# Altium project Battery PSU.PrjPCB (part 2 of 2)

## Sheet Lin-reg.SchDoc
size A4
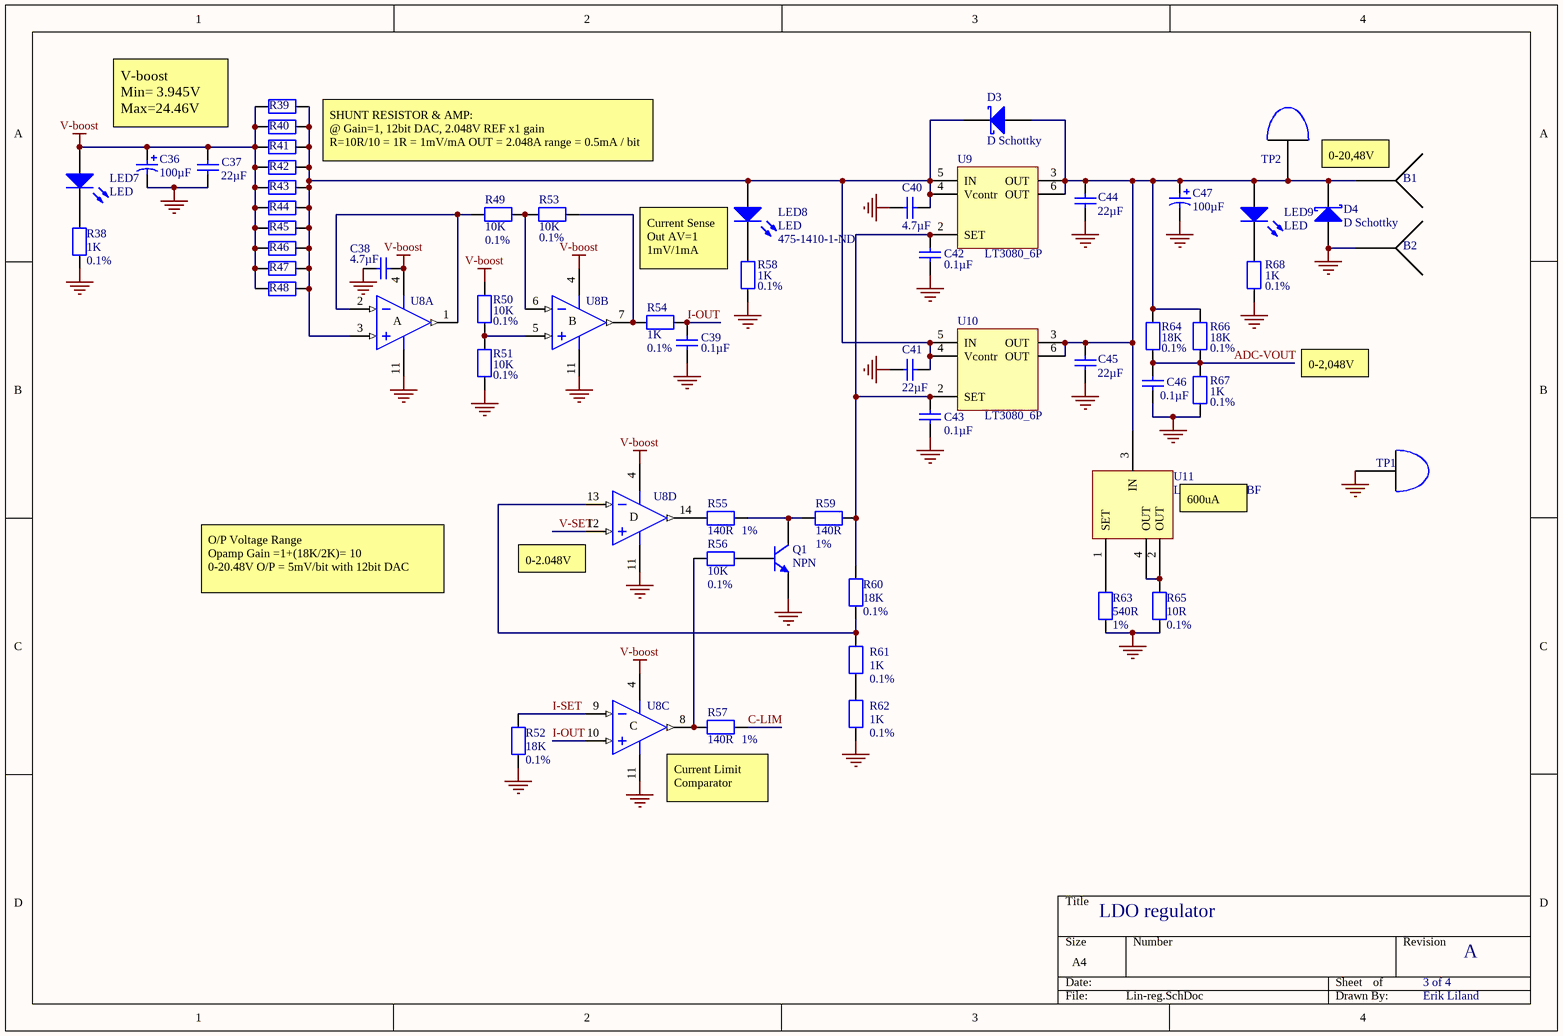
[diagram p2: Lin-reg.SchDoc]

### Parts
B1  Banana socket pcb  [PCB Banana jack red]  (value not drawn)
B2  Banana socket pcb  [PCB Banana jack black]  (value not drawn)
C36  100µF  [CAP SMD (F)]
C37  22µF  [0805_N_CAP]
C38  4.7µF  [0805_N_CAP]
C39  0.1µF  [0805_N_CAP]
C40  4.7µF  [0805_N_CAP]
C41  22µF  [0805_N_CAP]
C42  0.1µF  [0805_N_CAP]
C43  0.1µF  [0805_N_CAP]
C44  22µF  [0805_N_CAP]
C45  22µF  [0805_N_CAP]
C46  0.1µF  [0805_N_CAP]
C47  100µF  [CAP SMD (F)]
D3  D Schottky  [DO-214AC, SMA]
D4  D Schottky  [DO-214AC, SMA]
LED7  LED  [0805_N_LED]
LED8  LED  Supplier Part Number 1: 475-1410-1-ND  [0805_N_LED]
LED9  LED  [0805_N_LED]
Q1  NPN  [SOT-23_N]
R38  1K  Tolerance: 0.1%  [0805_N_RES]
R39  10R  [0805_N_RES]  (value not drawn)
R40  10R  [0805_N_RES]  (value not drawn)
R41  10R  [0805_N_RES]  (value not drawn)
R42  10R  [0805_N_RES]  (value not drawn)
R43  10R  [0805_N_RES]  (value not drawn)
R44  10R  [0805_N_RES]  (value not drawn)
R45  10R  [0805_N_RES]  (value not drawn)
R46  10R  [0805_N_RES]  (value not drawn)
R47  10R  [0805_N_RES]  (value not drawn)
R48  10R  [0805_N_RES]  (value not drawn)
R49  10K  Tolerance: 0.1%  [0805_N_RES]
R50  10K  Tolerance: 0.1%  [0805_N_RES]
R51  10K  Tolerance: 0.1%  [0805_N_RES]
R52  18K  Tolerance: 0.1%  [0805_N_RES]
R53  10K  Tolerance: 0.1%  [0805_N_RES]
R54  1K  Tolerance: 0.1%  [0805_N_RES]
R55  140R  Tolerance: 1%  [0805_N_RES]
R56  10K  Tolerance: 0.1%  [0805_N_RES]
R57  140R  Tolerance: 1%  [0805_N_RES]
R58  1K  Tolerance: 0.1%  [0805_N_RES]
R59  140R  Tolerance: 1%  [0805_N_RES]
R60  18K  Tolerance: 0.1%  [0805_N_RES]
R61  1K  Tolerance: 0.1%  [0805_N_RES]
R62  1K  Tolerance: 0.1%  [0805_N_RES]
R63  540R  Tolerance: 1%  [0805_N_RES]
R64  18K  Tolerance: 0.1%  [0805_N_RES]
R65  10R  Tolerance: 0.1%  [0805_N_RES]
R66  18K  Tolerance: 0.1%  [0805_N_RES]
R67  1K  Tolerance: 0.1%  [0805_N_RES]
R68  1K  Tolerance: 0.1%  [0805_N_RES]
TP1  Test-point  [Test point]  (value not drawn)
TP2  Test-point  [Test point]  (value not drawn)
U8  BA2902FV  [TSSOP14_N]  (value not drawn)  (parts A,B,C,D of 4)
U9  LT3080_6P  [DD-PAK-5_N_HEATSINK]
U10  LT3080_6P  [DD-PAK-5_N_HEATSINK]
U11  LT3092EST#PBF  [SOT223_N]

### Nets
GND: B2.1 C36.2 C37.2 C38.1 C39.1 C40.2 C41.2 C42.1 C43.1 C44.2 C45.2 C46.1 C47.2 D4.1(A) Q1.2(E) R38.1 R51.1 R52.1 R58.2 R62.2 R63.1 R65.2 R67.2 R68.2 TP1.1(TP) U8.11(VEE)
V-boost: C36.1 C37.1 C38.2 LED7.1(A) R39.2 R40.2 R41.2 R42.2 R43.2 R44.2 R45.2 R46.2 R47.2 R48.2 R50.2 U8.4(VCC)
ADC-VOUT: C46.2 R64.2 R66.2 R67.1
C-LIM: R57.2
I-OUT: C39.2 R54.1 U8.10(+IN3)
I-SET: R52.2 U8.9(-IN3)
V-SET: U8.12(+IN4)
NetB1_1: B1.1 C44.1 C45.1 C47.1 D3.1(A) D4.2(K) LED9.1(A) R64.1 R66.1 TP2.1(TP) U9.3(OUT) U9.6(OUT) U10.3(OUT) U10.6(OUT) U11.3(IN)
NetC40_1: C40.1 C41.1 D3.2(K) LED8.1(A) R39.1 R40.1 R41.1 R42.1 R43.1 R44.1 R45.1 R46.1 R47.1 R48.1 U8.3(+IN1) U9.4(Vcontr) U9.5(IN) U10.4(Vcontr) U10.5(IN)
NetC42_2: C42.2 C43.2 R59.2 R60.1 U9.2(SET) U10.2(SET)
NetLED7_2: LED7.2(K) R38.2
NetLED8_2: LED8.2(K) R58.1
NetLED9_2: LED9.2(K) R68.1
NetQ1_1: Q1.1(B) R56.1
NetQ1_3: Q1.3(C) R55.2 R59.1
NetR49_1: R49.1 U8.1(OUT1) U8.2(-IN1)
NetR49_2: R49.2 R53.1 U8.6(-IN2)
NetR50_1: R50.1 R51.2 U8.5(+IN2)
NetR53_2: R53.2 R54.2 U8.7(OUT2)
NetR55_1: R55.1 U8.14(OUT4)
NetR56_2: R56.2 R57.1 U8.8(OUT3)
NetR60_2: R60.2 R61.1 U8.13(-IN4)
NetR61_2: R61.2 R62.1
NetR63_2: R63.2 U11.1(SET)
NetR65_1: R65.1 U11.2(OUT) U11.4(OUT)

### Notes on the sheet
- V-boost
  Min= 3.945V
  Max=24.46V
- SHUNT RESISTOR & AMP:
  @ Gain=1, 12bit DAC, 2.048V REF x1 gain
  R=10R/10 = 1R = 1mV/mA OUT = 2.048A range = 0.5mA / bit
- (near B1) 0-20,48V
- Current Sense Out AV=1
  1mV/1mA
- 0-2,048V
- (near U11) 600uA
- (near U8) 0-2.048V
- O/P Voltage Range
  Opamp Gain =1+(18K/2K)= 10
  0-20.48V O/P = 5mV/bit with 12bit DAC
- (near U8) Current Limit Comparator
- LDO regulator
- 3 of 4
- A
- Erik Liland
- (in symbol BA2902FV, part A) A
- (in symbol BA2902FV, part B) B
- (in symbol BA2902FV, part C) C
- (in symbol BA2902FV, part D) D

### Library data of the parts
B1 B2 = Banana socket pcb: 2.54mm skrew terminal; Supplier 1: Farnell
  B1: Supplier Part Number 1: 1854508
  B2: Supplier Part Number 1: 1854507
C36 C47 = Cap Pol: Polarized Capacitor; Manufacturer: Panasonic Electronic Components; Manufacturer Part Number: EEH-ZA1H101P; Tolerance: ±20%; ESR (Equivalent Series Resistance): 28 mOhm; Lifetime @ Temp.: 10000 Hrs @ 105°C; Type: Polymer - Hybrid; Ripple Current: 2A; Surface Mount Land Size: 0.406" L x 0.406" W (10.30mm x 10.30mm); Voltage - Rated: 50V; Supplier 1: Digi-Key; Supplier Part Number 1: P15442CT-ND; RoHS: RoHS Compliant; Category: Capacitors; Stock 1: 4202; Pricing 1: 1=2.9, 10=2.406, 25=2.2996, 50=2.229, 100=2.1227, 250=1.98124 (EUR); Packaging: Cut Tape (CT); Capacitance: 100µF; Operating Temperature: -55°C ~ 105°C; Size / Dimension: 0.394" Dia (10.00mm); Height - Seated (Max): 0.413" (10.50mm); Mounting Type: Surface Mount; Package / Case: Radial, Can - SMD; ComponentLink1URL: http://industrial.panasonic.com/www-data/pdf/ABA0000/ABA0000CE136.pdf; ComponentLink1Description: http://industrial.panasonic.com/www-data/pdf/ABA0000/ABA0000CE136.pdf
C37 C41 C44 C45 = Cap: Capacitor; Manufacturer: TDK Corporation; Manufacturer Part Number: C2012X5R1V226M125AC; Tolerance: ±20%; Voltage - Rated: 35V; Temperature Coefficient: X5R; Supplier 1: Digi-Key; Supplier Part Number 1: 445-14428-1-ND; RoHS: RoHS Compliant; Category: Capacitors; Stock 1: 68492; Pricing 1: 1=1.19, 10=0.996, 100=0.6357, 250=0.52976, 500=0.47676, 1000=0.42586 (EUR); Packaging: Cut Tape (CT); Capacitance: 22µF; Mounting Type: Surface Mount, MLCC; Operating Temperature: -55°C ~ 85°C; Package / Case: 0805 (2012 Metric); Size / Dimension: 0.079" L x 0.049" W (2.00mm x 1.25mm); Height - Seated (Max): -; Thickness (Max): 0.057" (1.45mm); ComponentLink1URL: http://product.tdk.com/en/catalog/datasheets/mlcc_commercial_general_en.pdf; ComponentLink1Description: http://product.tdk.com/en/catalog/datasheets/mlcc_commercial_general_en.pdf
C38 C40 = Cap: Capacitor; Manufacturer: Samsung Electro-Mechanics America, Inc; Manufacturer Part Number: CL21B475KOFNFNE; Tolerance: ±10%; Voltage - Rated: 16V; Temperature Coefficient: X7R; Supplier 1: Digi-Key; Supplier Part Number 1: 1276-2970-1-ND; RoHS: RoHS Compliant; Category: Capacitors; Stock 1: 58798; Pricing 1: 1=0.27, 10=0.18, 25=0.1308, 100=0.0915, 500=0.06538, 1000=0.05557 (EUR); Packaging: Cut Tape (CT); Capacitance: 4.7µF; Mounting Type: Surface Mount, MLCC; Operating Temperature: -55°C ~ 125°C; Package / Case: 0805 (2012 Metric); Size / Dimension: 0.079" L x 0.049" W (2.00mm x 1.25mm); Height - Seated (Max): -; Thickness (Max): 0.053" (1.35mm); ComponentLink1URL: http://www.samsungsem.com/kr/front/downloadcms.do?path=/kr/support/product-search/mlcc/__icsFiles/afieldfile/2014/11/05&fileName=S_CL21B475KOFNFNE.pdf; ComponentLink1Description: http://www.samsungsem.com/kr/front/downloadcms.do?path=/kr/support/product-search/mlcc/__icsFiles/afieldfile/2014/11/05&fileName=S_CL21B475KOFNFNE.pdf
C39 C42 C43 C46 = Cap: Capacitor; Manufacturer: Kemet; Manufacturer Part Number: C0805C104K4RACTU; Temperature Coefficient: X7R; Tolerance: ±10%; Voltage - Rated: 16V; Capacitance: 0.1µF; Category: Capacitors; ComponentLink1Description: http://www.kemet.com/docfinder?Partnumber=C0805C104K4RACTU; ComponentLink1URL: http://www.kemet.com/docfinder?Partnumber=C0805C104K4RACTU; Height - Seated (Max): -; Mounting Type: Surface Mount, MLCC; Operating Temperature: -55°C ~ 125°C; Package / Case: 0805 (2012 Metric); Packaging: Cut Tape (CT); Pricing 1: 1=0.11, 10=0.076, 50=0.0436, 100=0.0359, 250=0.03024, 500=0.02534, 1000=0.02081 (EUR); RoHS: RoHS Compliant; Size / Dimension: 0.079" L x 0.049" W (2.00mm x 1.25mm); Stock 1: 286232; Supplier 1: Digi-Key; Supplier Part Number 1: 399-1167-1-ND; Thickness (Max): 0.035" (0.88mm)
D3 D4 = D Schottky: Schottky Diode; Manufacturer: Micro Commercial Co; Manufacturer Part Number: SK33A-TP; Voltage - DC Reverse (Vr) (Max): 30V; Current - Average Rectified (Io): 3A; Voltage - Forward (Vf) (Max) @ If: 500mV @ 3A; Speed: Fast Recovery =< 500ns, > 200mA (Io); Current - Reverse Leakage @ Vr: 500µA @ 30V; Capacitance @ Vr, F: 250pF @ 4V, 1MHz; Supplier 1: Digi-Key; Supplier Part Number 1: SK33A-TPCT-ND; RoHS: RoHS Compliant; Category: Discrete Semiconductor Products; Stock 1: 4384; Pricing 1: 1=0.57, 10=0.403, 25=0.3316, 100=0.2649, 250=0.19304, 500=0.15676, 1000=0.1205 (EUR); Packaging: Cut Tape (CT); Diode Type: Schottky; Reverse Recovery Time (trr): -; Mounting Type: Surface Mount; Package / Case: DO-214AC, SMA; Supplier Device Package: DO-214AC (HSMA); Operating Temperature - Junction: -50°C ~ 125°C; ComponentLink1URL: http://www.mccsemi.com/up_pdf/SK32A-SK310A(HSMA).PDF; ComponentLink1Description: http://www.mccsemi.com/up_pdf/SK32A-SK310A(HSMA).PDF; Published: 8-Jun-2000; LatestRevisionDate: 17-Jul-2002; LatestRevisionNote: Re-released for DXP Platform.; PackageReference: SMB; Publisher: Altium Limited; PackageDescription: DO-214-AA/SMB; 2 C-Bend Leads; Body 5.3 x 3.6 mm, inc. leads (LxW); Code_JEDEC: DO-214-AA
LED7-LED9 = LED: Typical RED, GREEN, YELLOW, AMBER; Manufacturer: OSRAM Opto Semiconductors Inc; Manufacturer Part Number: LG R971-KN-1; Wavelength - Dominant: 570nm; Wavelength - Peak: 572nm; Millicandela Rating: 26.05mcd; Voltage - Forward (Vf) (Typ): 2.2V; Current - Test: 20mA; Viewing Angle: 160°; Lens Style/Size: Rectangle with Flat Top, 1.30mm x 1.25mm; Lens Transparency: Diffused; Lens Color: White; Supplier 1: Digi-Key; RoHS: RoHS Compliant; Category: Optoelectronics; Stock 1: 152991; Pricing 1: 1=0.1, 10=0.087, 100=0.0691, 250=0.06048, 500=0.05526 (EUR); Packaging: Cut Tape (CT); Color: Green; Package / Case: 0805 (2012 Metric); Size / Dimension: 2.00mm L x 1.25mm W; Mounting Type: Surface Mount; ComponentLink1URL: http://www.osram-os.com/Graphics/XPic9/00078860_0.pdf; ComponentLink1Description: http://www.osram-os.com/Graphics/XPic9/00078860_0.pdf; Supplier Device Package: *; Height (Max): 0.90mm
  LED7 LED9: Supplier Part Number 1: 475-1410-1-ND
Q1 = NPN Transistor: NPN General Purpose Amplifier; Manufacturer: Micro Commercial Co; Manufacturer Part Number: MMBT3904-TP; Current - Collector (Ic) (Max): 200mA; Voltage - Collector Emitter Breakdown (Max): 40V; Vce Saturation (Max) @ Ib, Ic: 300mV @ 5mA, 50mA; DC Current Gain (hFE) (Min) @ Ic, Vce: 100 @ 10mA, 1V; Power - Max: 350mW; Frequency - Transition: 300MHz; Supplier 1: Digi-Key; Supplier Part Number 1: MMBT3904TPMSCT-ND; RoHS: RoHS Compliant; Category: Discrete Semiconductor Products; Stock 1: 108373; Pricing 1: 1=0.14, 10=0.128, 25=0.1168, 100=0.0841, 250=0.04956, 500=0.04112, 1000=0.02805 (EUR); Packaging: Cut Tape (CT); Transistor Type: NPN; Current - Collector Cutoff (Max): -; Mounting Type: Surface Mount; Package / Case: TO-236-3, SC-59, SOT-23-3; Supplier Device Package: SOT-23; ComponentLink1URL: http://www.mccsemi.com/up_pdf/MMBT3904(SOT-23).pdf; ComponentLink1Description: http://www.mccsemi.com/up_pdf/MMBT3904(SOT-23).pdf
R38 R54 R58 R61 R62 R67 R68 = Res: Resistor; Manufacturer: Panasonic Electronic Components; Manufacturer Part Number: ERA-6AEB102V; Power (Watts): 0.125W, 1/8W; Temperature Coefficient: ±25ppm/°C; Value: 1K; Category: Resistors; ComponentLink1Description: http://industrial.panasonic.com/www-cgi/jvcr13pz.cgi?E+PZ+3+AOA0026+ERA6AEB102V+7+WW; ComponentLink1URL: http://industrial.panasonic.com/www-cgi/jvcr13pz.cgi?E+PZ+3+AOA0026+ERA6AEB102V+7+WW; Composition: Thin Film; Height: 0.024" (0.60mm); Number of Terminations: 2; Operating Temperature: -55°C ~ 155°C; Package / Case: 0805 (2012 Metric); Packaging: Cut Tape (CT); Pricing 1: 1=0.64, 50=0.2516, 100=0.194, 250=0.15092, 500=0.10636, 1000=0.07761 (EUR); Resistance (Ohms): 1k; RoHS: RoHS Compliant; Size / Dimension: 0.079" L x 0.049" W (2.00mm x 1.25mm); Stock 1: 142110; Supplier 1: Digi-Key; Supplier Device Package: 0805; Supplier Part Number 1: P1.0KDACT-ND
R39 = Res: Resistor; Manufacturer: TE Connectivity AMP Connectors; Manufacturer Part Number: 2-1625868-7; Tolerance: 0.1%; Resistance (Ohms): 10; Power (Watts): 0.25W, 1/4W; Temperature Coefficient: ±25ppm/°C; Value: 10R; Category: Resistors; Supplier 1: Digi-Key; Supplier Part Number 1: A110351CT-ND; RoHS: RoHS Compliant; Stock 1: 1716; Pricing 1: 1=0.24, 10=0.222, 100=0.1967 (EUR); Packaging: Cut Tape (CT); Composition: Thin Film; Operating Temperature: -55°C ~ 155°C; Package / Case: 0805 (2012 Metric); Supplier Device Package: 0805; Size / Dimension: 0.079" L x 0.049" W (2.00mm x 1.25mm); Height: 0.026" (0.65mm); Number of Terminations: 2; ComponentLink1URL: http://www.te.com/commerce/DocumentDelivery/DDEController?Action=srchrtrv&DocNm=1773272&DocType=DS&DocLang=English; ComponentLink1Description: http://www.te.com/commerce/DocumentDelivery/DDEController?Action=srchrtrv&DocNm=1773272&DocType=DS&DocLang=English
R40-R48 = Res: Resistor; Manufacturer: TE Connectivity AMP Connectors; Manufacturer Part Number: 2-1625868-7; Tolerance: 0.1%; Power (Watts): 0.25W, 1/4W; Resistance (Ohms): 10; Temperature Coefficient: ±25ppm/°C; Value: 10R; Category: Resistors; ComponentLink1Description: http://www.te.com/commerce/DocumentDelivery/DDEController?Action=srchrtrv&DocNm=1773272&DocType=DS&DocLang=English; ComponentLink1URL: http://www.te.com/commerce/DocumentDelivery/DDEController?Action=srchrtrv&DocNm=1773272&DocType=DS&DocLang=English; Composition: Thin Film; Height: 0.026" (0.65mm); Number of Terminations: 2; Operating Temperature: -55°C ~ 155°C; Package / Case: 0805 (2012 Metric); Packaging: Cut Tape (CT); Pricing 1: 1=0.24, 10=0.222, 100=0.1967 (EUR); RoHS: RoHS Compliant; Size / Dimension: 0.079" L x 0.049" W (2.00mm x 1.25mm); Stock 1: 1716; Supplier 1: Digi-Key; Supplier Device Package: 0805; Supplier Part Number 1: A110351CT-ND
R49-R51 R53 R56 = Res: Resistor; Manufacturer: TE Connectivity AMP Connectors; Manufacturer Part Number: 8-1614884-4; Power (Watts): 0.1W, 1/10W; Temperature Coefficient: ±25ppm/°C; Value: 10K; Category: Resistors; Supplier 1: Digi-Key; Supplier Part Number 1: A103142CT-ND; RoHS: RoHS Compliant; Stock 1: 18690; Pricing 1: 1=0.18, 100=0.1714, 500=0.16136 (EUR); Packaging: Cut Tape (CT); Resistance (Ohms): 10k; Composition: Thin Film; Operating Temperature: -55°C ~ 155°C; Package / Case: 0805 (2012 Metric); Supplier Device Package: 0805; Size / Dimension: 0.079" L x 0.049" W (2.00mm x 1.25mm); Height: 0.026" (0.65mm); Number of Terminations: 2; ComponentLink1URL: http://www.te.com/commerce/DocumentDelivery/DDEController?Action=srchrtrv&DocNm=1773200&DocType=DS&DocLang=English; ComponentLink1Description: http://www.te.com/commerce/DocumentDelivery/DDEController?Action=srchrtrv&DocNm=1773200&DocType=DS&DocLang=English
R52 R60 R64 R66 = Res: Resistor; Manufacturer: Panasonic Electronic Components; Manufacturer Part Number: ERA-6AEB183V; Power (Watts): 0.125W, 1/8W; Temperature Coefficient: ±25ppm/°C; Value: 18K; Category: Resistors; Supplier 1: Digi-Key; Supplier Part Number 1: P18KDACT-ND; RoHS: RoHS Compliant; Stock 1: 21371; Pricing 1: 1=0.64, 50=0.2516, 100=0.194, 250=0.15092, 500=0.10636, 1000=0.07761 (EUR); Packaging: Cut Tape (CT); Resistance (Ohms): 18k; Composition: Thin Film; Operating Temperature: -55°C ~ 155°C; Package / Case: 0805 (2012 Metric); Supplier Device Package: 0805; Size / Dimension: 0.079" L x 0.049" W (2.00mm x 1.25mm); Height: 0.024" (0.60mm); Number of Terminations: 2; ComponentLink1URL: http://industrial.panasonic.com/www-cgi/jvcr13pz.cgi?E+PZ+3+AOA0026+ERA6AEB183V+7+WW; ComponentLink1Description: http://industrial.panasonic.com/www-cgi/jvcr13pz.cgi?E+PZ+3+AOA0026+ERA6AEB183V+7+WW
R55 R57 R59 = Res: Resistor; Manufacturer: Samsung Electro-Mechanics America, Inc; Manufacturer Part Number: RC2012F1400CS; Power (Watts): 0.125W, 1/8W; Resistance (Ohms): 140; Temperature Coefficient: ±100ppm/°C; Value: 140R; Category: Resistors; ComponentLink1Description: http://www.samsungsem.com/global/support/library/product-catalog/__icsFiles/afieldfile/2015/01/12/CHIP_RESISTOR_150112_1.pdf; ComponentLink1URL: http://www.samsungsem.com/global/support/library/product-catalog/__icsFiles/afieldfile/2015/01/12/CHIP_RESISTOR_150112_1.pdf; Composition: Thick Film; Height: 0.024" (0.60mm); Number of Terminations: 2; Operating Temperature: -55°C ~ 155°C; Package / Case: 0805 (2012 Metric); Packaging: Cut Tape (CT); Pricing 1: 1=0.1, 10=0.022, 25=0.016, 100=0.0092, 500=0.00558, 1000=0.00411, 2500=0.00358 (EUR); RoHS: RoHS Compliant; Size / Dimension: 0.079" L x 0.049" W (2.00mm x 1.25mm); Stock 1: 7060; Supplier 1: Digi-Key; Supplier Device Package: 0805 (2012 Metric); Supplier Part Number 1: 1276-5229-1-ND
R63 = Res: Resistor; Value: 540R; Category: Resistors
R65 = Res: Resistor; Manufacturer: TE Connectivity AMP Connectors; Manufacturer Part Number: 2-1625868-7; Power (Watts): 0.25W, 1/4W; Resistance (Ohms): 10; Temperature Coefficient: ±25ppm/°C; Value: 10R; Category: Resistors; ComponentLink1Description: http://www.te.com/commerce/DocumentDelivery/DDEController?Action=srchrtrv&DocNm=1773272&DocType=DS&DocLang=English; ComponentLink1URL: http://www.te.com/commerce/DocumentDelivery/DDEController?Action=srchrtrv&DocNm=1773272&DocType=DS&DocLang=English; Composition: Thin Film; Height: 0.026" (0.65mm); Number of Terminations: 2; Operating Temperature: -55°C ~ 155°C; Package / Case: 0805 (2012 Metric); Packaging: Cut Tape (CT); Pricing 1: 1=0.24, 10=0.222, 100=0.1967 (EUR); RoHS: RoHS Compliant; Size / Dimension: 0.079" L x 0.049" W (2.00mm x 1.25mm); Stock 1: 1716; Supplier 1: Digi-Key; Supplier Device Package: 0805; Supplier Part Number 1: A110351CT-ND
TP1 TP2 = Test point
U8 = BA2902FV: Quad Low-Power Operational Amplifier; Manufacturer: Rohm Semiconductor; Manufacturer Part Number: BA2902FV-E2; Amplifier Type: General Purpose; Number of Circuits: 4; Slew Rate: 0.2 V/µs; Gain Bandwidth Product: 500kHz; Current - Input Bias: 20nA; Voltage - Input Offset: 2mV; Current - Supply: 700µA; Current - Output / Channel: 30mA; Voltage - Supply, Single/Dual (±): 3 V ~ 32 V, ±1.5 V ~ 16 V; Supplier 1: Digi-Key; RoHS: RoHS Compliant; Category: Integrated Circuits (ICs); Stock 1: 9768; Pricing 1: 1=0.87, 10=0.76, 25=0.6724, 100=0.586, 250=0.51012, 500=0.4342, 1000=0.34779 (EUR); Packaging: Cut Tape (CT); Output Type: -; -3db Bandwidth: -; Operating Temperature: -40°C ~ 125°C; Mounting Type: Surface Mount; Package / Case: 14-LSSOP (0.173", 4.40mm Width); Supplier Device Package: 14-SSOP; ComponentLink1URL: http://rohmfs.rohm.com/en/products/databook/datasheet/ic/amp_linear/opamp/ba10358f-e.pdf; ComponentLink1Description: http://rohmfs.rohm.com/en/products/databook/datasheet/ic/amp_linear/opamp/ba10358f-e.pdf; Supplier Part Number 1: BA2902FV-E2CT-ND
U9 U10 = LT3080_6P: LT3080 LDO regulator; Manufacturer: Linear Technology; Manufacturer Part Number: LT3080EQ#PBF; Regulator Topology: Positive Adjustable; Voltage - Output: 0 V ~ 36 V; Current - Output: 1.1A; Voltage - Dropout (Typical): 1.35V @ 1.1A; Number of Regulators: 1; Voltage - Input: 1.2 V ~ 36 V; Supplier 1: Digi-Key; Supplier Part Number 1: LT3080EQ#PBF-ND; RoHS: RoHS Compliant; Category: Integrated Circuits (ICs); Stock 1: 1598; Pricing 1: 1=4.68, 25=3.3412, 100=2.8409 (EUR); Packaging: Tube; Current - Limit (Min): 1.1A; Operating Temperature: -40°C ~ 125°C; Mounting Type: Surface Mount; Package / Case: TO-263-6, D²Pak (5 Leads + Tab), TO-263BA; Supplier Device Package: 5-DDPAK; ComponentLink1URL: http://www.linear.com/docs/25276; ComponentLink1Description: http://www.linear.com/docs/25276
U11 = LT3092: Current source; Manufacturer: Linear Technology; Accuracy: ±1%; Voltage - Input: 1.2 V ~ 40 V; Current - Output: 200mA; RoHS: RoHS Compliant; ComponentLink1Description: http://www.linear.com/docs/27892; ComponentLink1URL: http://www.linear.com/docs/27892; Supplier 1: Digi-Key; Supplier Part Number 1: LT3092EST#PBF-ND; Manufacturer Part Number: LT3092EST#PBF; Category: Integrated Circuits (ICs); Stock 1: 3473; Pricing 1: 1=3.98, 25=2.66, 100=2.2664 (EUR); Packaging: Tube; Function: Current Source; Sensing Method: -; Operating Temperature: -40°C ~ 125°C; Mounting Type: Surface Mount; Package / Case: TO-261-4, TO-261AA; Supplier Device Package: SOT-223

## Sheet BatteruPSU_SM-reg.SchDoc
size A4
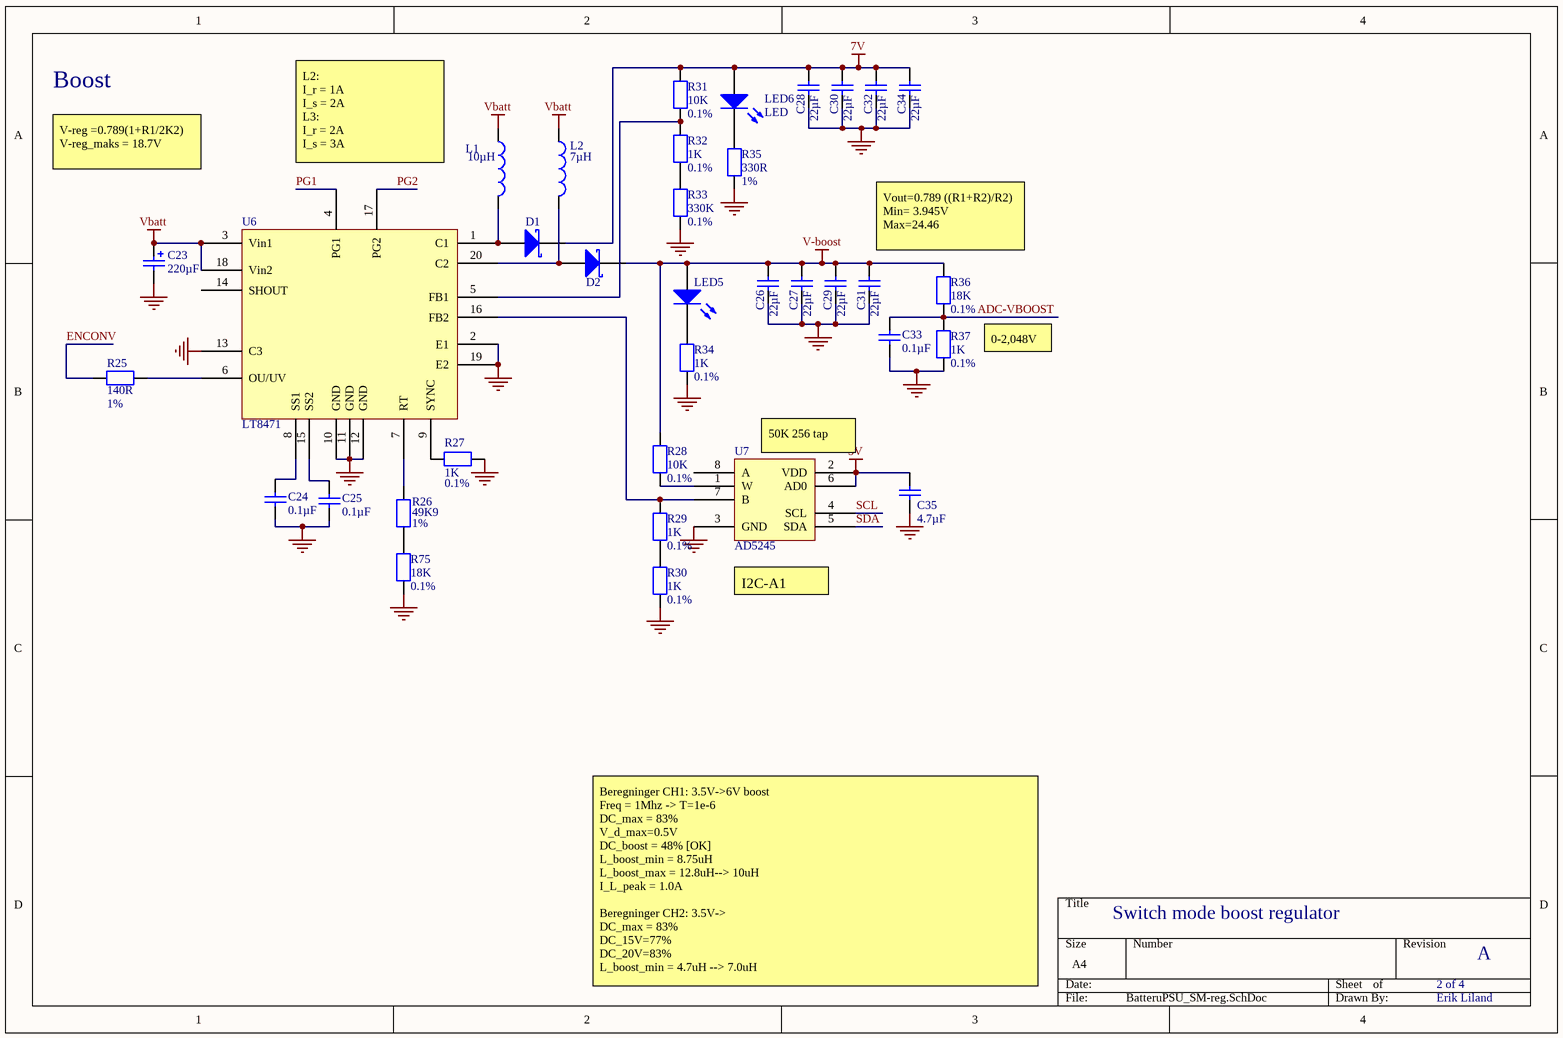
[diagram p3: BatteruPSU_SM-reg.SchDoc]

### Parts
C23  220µF  [CAP SMD (F)]
C24  0.1µF  [0805_N_CAP]
C25  0.1µF  [0805_N_CAP]
C26  22µF  [0805_N_CAP]
C27  22µF  [0805_N_CAP]
C28  22µF  [0805_N_CAP]
C29  22µF  [0805_N_CAP]
C30  22µF  [0805_N_CAP]
C31  22µF  [0805_N_CAP]
C32  22µF  [0805_N_CAP]
C33  0.1µF  [0805_N_CAP]
C34  22µF  [0805_N_CAP]
C35  4.7µF  [0805_N_CAP]
D1  D Schottky  [DO-214AC, SMA]  (value not drawn)
D2  D Schottky  [DO-214AC, SMA]  (value not drawn)
L1  Inductance: 10µH  [Inductor wirewound]  (hidden comment: Inductor)
L2  Inductance: 7µH  [Inductor wirewound]  (hidden comment: Inductor)
LED5  LED  [0805_N_LED]  (value not drawn)
LED6  LED  [0805_N_LED]
R25  140R  Tolerance: 1%  [0805_N_RES]
R26  49K9  Tolerance: 1%  [0805_N_RES]
R27  1K  Tolerance: 0.1%  [0805_N_RES]
R28  10K  Tolerance: 0.1%  [0805_N_RES]
R29  1K  Tolerance: 0.1%  [0805_N_RES]
R30  1K  Tolerance: 0.1%  [0805_N_RES]
R31  10K  Tolerance: 0.1%  [0805_N_RES]
R32  1K  Tolerance: 0.1%  [0805_N_RES]
R33  330K  Tolerance: 0.1%  [0805_N_RES]
R34  1K  Tolerance: 0.1%  [0805_N_RES]
R35  330R  Tolerance: 1%  [0805_N_RES]
R36  18K  Tolerance: 0.1%  [0805_N_RES]
R37  1K  Tolerance: 0.1%  [0805_N_RES]
R75  18K  Tolerance: 0.1%  [0805_N_RES]
U6  LT8471  [TSSOP20_N]
U7  AD5245  [SOT-23-8]

### Nets
5V: C35.1 U7.2(VDD) U7.6(AD0)
7V: C28.1 C30.1 C32.1 C34.1 D1.2(K) LED6.1(A) R31.2
GND: C23.2 C24.1 C25.1 C26.2 C27.2 C28.2 C29.2 C30.2 C31.2 C32.2 C33.1 C34.2 C35.2 R27.2 R30.1 R33.2 R34.1 R35.2 R37.2 R75.2 U6.2(E1) U6.10(GND) U6.11(GND) U6.12(GND) U6.13(C3) U6.19(E2) U7.3(GND)
V-boost: C26.1 C27.1 C29.1 C31.1 D2.2(K) LED5.1(A) R28.2 R36.1
Vbatt: C23.1 L1.1 L2.1 U6.3(Vin1) U6.18(Vin2)
ADC-VBOOST: C33.2 R36.2 R37.1
ENCONV: R25.1
PG1: U6.4(PG1)
PG2: U6.17(PG2)
SCL: U7.4(SCL)
SDA: U7.5(SDA)
NetC24_2: C24.2 U6.8(SS1)
NetC25_2: C25.2 U6.15(SS2)
NetD1_1: D1.1(A) L1.2 U6.1(C1)
NetD2_1: D2.1(A) L2.2 U6.20(C2)
NetLED5_2: LED5.2(K) R34.2
NetLED6_2: LED6.2(K) R35.1
NetR25_2: R25.2 U6.6(OU/UV)
NetR26_1: R26.1 R75.1
NetR26_2: R26.2 U6.7(RT)
NetR27_1: R27.1 U6.9(SYNC)
NetR28_1: R28.1 U7.1(W)
NetR29_1: R29.1 R30.2
NetR29_2: R29.2 U6.16(FB2) U7.7(B)
NetR31_1: R31.1 R32.2 U6.5(FB1)
NetR32_1: R32.1 R33.1

Not connected (* = marked no-connect by the designer): U6 14(SHOUT); U7 8(A)

### Notes on the sheet
- Boost
- V-reg =0.789(1+R1/2K2)
  V-reg_maks = 18.7V
- L2:
  I_r = 1A
  I_s = 2A
  L3:
  I_r = 2A
  I_s = 3A
- Vout=0.789 ((R1+R2)/R2)
  Min= 3.945V
  Max=24.46
- 0-2,048V
- (near U7) 50K 256 tap
- (near U7) I2C-A1
- Switch mode boost regulator
- Beregninger CH1: 3.5V->6V boost
  Freq = 1Mhz -> T=1e-6
  DC_max = 83%
  V_d_max=0.5V
  DC_boost = 48%	[OK]
  L_boost_min = 8.75uH
  L_boost_max = 12.8uH--> 10uH
  I_L_peak = 1.0A
  Beregninger CH2: 3.5V->
  DC_max = 83%
  DC_15V=77%
  DC_20V=83%
  L_boost_min = 4.7uH --> 7.0uH
- 2 of 4
- A
- Erik Liland

### Library data of the parts
C23 = Cap Pol: Polarized Capacitor; Manufacturer: Panasonic Electronic Components; Manufacturer Part Number: EEH-ZA1E221P; Tolerance: ±20%; ESR (Equivalent Series Resistance): 27 mOhm; Lifetime @ Temp.: 10000 Hrs @ 105°C; Type: Polymer - Hybrid; Ripple Current: 2.3A; Surface Mount Land Size: 0.327" L x 0.327" W (8.30mm x 8.30mm); Voltage - Rated: 25V; Supplier 1: Digi-Key; Supplier Part Number 1: P15437CT-ND; RoHS: RoHS Compliant; Category: Capacitors; Stock 1: 3490; Pricing 1: 1=2.68, 10=2.221, 25=2.1228, 50=2.0572, 100=1.9594, 250=1.82872 (EUR); Packaging: Cut Tape (CT); Capacitance: 220µF; Operating Temperature: -55°C ~ 105°C; Size / Dimension: 0.315" Dia (8.00mm); Height - Seated (Max): 0.413" (10.50mm); Mounting Type: Surface Mount; Package / Case: Radial, Can - SMD; ComponentLink1URL: http://industrial.panasonic.com/www-data/pdf/ABA0000/ABA0000CE136.pdf; ComponentLink1Description: http://industrial.panasonic.com/www-data/pdf/ABA0000/ABA0000CE136.pdf
C24 C25 C33 = Cap: as C39 on sheet Lin-reg; Capacitance: 0.1µF; Category: Capacitors; ComponentLink1Description: http://www.kemet.com/docfinder?Partnumber=C0805C104K4RACTU; ComponentLink1URL: http://www.kemet.com/docfinder?Partnumber=C0805C104K4RACTU; Height - Seated (Max): -; Mounting Type: Surface Mount, MLCC; Operating Temperature: -55°C ~ 125°C; Package / Case: 0805 (2012 Metric); Packaging: Cut Tape (CT); Pricing 1: 1=0.11, 10=0.076, 50=0.0436, 100=0.0359, 250=0.03024, 500=0.02534, 1000=0.02081 (EUR); RoHS: RoHS Compliant; Size / Dimension: 0.079" L x 0.049" W (2.00mm x 1.25mm); Stock 1: 286232; Supplier 1: Digi-Key; Supplier Part Number 1: 399-1167-1-ND; Thickness (Max): 0.035" (0.88mm)
C26 C27 C29 C31 = Cap: as C37 on sheet Lin-reg; Supplier 1: Digi-Key; Supplier Part Number 1: 445-14428-1-ND; RoHS: RoHS Compliant; Category: Capacitors; Stock 1: 68492; Pricing 1: 1=1.19, 10=0.996, 100=0.6357, 250=0.52976, 500=0.47676, 1000=0.42586 (EUR); Packaging: Cut Tape (CT); Capacitance: 22µF; Mounting Type: Surface Mount, MLCC; Operating Temperature: -55°C ~ 85°C; Package / Case: 0805 (2012 Metric); Size / Dimension: 0.079" L x 0.049" W (2.00mm x 1.25mm); Height - Seated (Max): -; Thickness (Max): 0.057" (1.45mm); ComponentLink1URL: http://product.tdk.com/en/catalog/datasheets/mlcc_commercial_general_en.pdf; ComponentLink1Description: http://product.tdk.com/en/catalog/datasheets/mlcc_commercial_general_en.pdf
C28 C30 C32 C34 = Cap: Capacitor; Manufacturer: Murata Electronics North America; Manufacturer Part Number: GRM21BR61A226ME51L; Tolerance: ±20%; Voltage - Rated: 10V; Temperature Coefficient: X5R; Supplier 1: Digi-Key; Supplier Part Number 1: 490-10511-1-ND; RoHS: RoHS Compliant; Category: Capacitors; Stock 1: 429; Pricing 1: 1=0.26, 10=0.212, 25=0.1452, 50=0.119, 100=0.1056, 250=0.07924, 500=0.07, 1000=0.06207 (EUR); Packaging: Cut Tape (CT); Capacitance: 22µF; Mounting Type: Surface Mount, MLCC; Operating Temperature: -55°C ~ 85°C; Package / Case: 0805 (2012 Metric); Size / Dimension: 0.079" L x 0.049" W (2.00mm x 1.25mm); Height - Seated (Max): -; Thickness (Max): 0.055" (1.40mm); ComponentLink1URL: http://www.murata.com/~/media/webrenewal/support/library/catalog/products/capacitor/mlcc/c02e.ashx; ComponentLink1Description: http://www.murata.com/~/media/webrenewal/support/library/catalog/products/capacitor/mlcc/c02e.ashx
C35 = Cap: as C38 on sheet Lin-reg; Supplier 1: Digi-Key; Supplier Part Number 1: 1276-2970-1-ND; RoHS: RoHS Compliant; Category: Capacitors; Stock 1: 58798; Pricing 1: 1=0.27, 10=0.18, 25=0.1308, 100=0.0915, 500=0.06538, 1000=0.05557 (EUR); Packaging: Cut Tape (CT); Capacitance: 4.7µF; Mounting Type: Surface Mount, MLCC; Operating Temperature: -55°C ~ 125°C; Package / Case: 0805 (2012 Metric); Size / Dimension: 0.079" L x 0.049" W (2.00mm x 1.25mm); Height - Seated (Max): -; Thickness (Max): 0.053" (1.35mm); ComponentLink1URL: http://www.samsungsem.com/kr/front/downloadcms.do?path=/kr/support/product-search/mlcc/__icsFiles/afieldfile/2014/11/05&fileName=S_CL21B475KOFNFNE.pdf; ComponentLink1Description: http://www.samsungsem.com/kr/front/downloadcms.do?path=/kr/support/product-search/mlcc/__icsFiles/afieldfile/2014/11/05&fileName=S_CL21B475KOFNFNE.pdf
D1 D2 = D Schottky: as D3 on sheet Lin-reg; Supplier 1: Digi-Key; Supplier Part Number 1: SK33A-TPCT-ND; RoHS: RoHS Compliant; Category: Discrete Semiconductor Products; Stock 1: 4384; Pricing 1: 1=0.57, 10=0.403, 25=0.3316, 100=0.2649, 250=0.19304, 500=0.15676, 1000=0.1205 (EUR); Packaging: Cut Tape (CT); Diode Type: Schottky; Reverse Recovery Time (trr): -; Mounting Type: Surface Mount; Package / Case: DO-214AC, SMA; Supplier Device Package: DO-214AC (HSMA); Operating Temperature - Junction: -50°C ~ 125°C; ComponentLink1URL: http://www.mccsemi.com/up_pdf/SK32A-SK310A(HSMA).PDF; ComponentLink1Description: http://www.mccsemi.com/up_pdf/SK32A-SK310A(HSMA).PDF; Published: 8-Jun-2000; LatestRevisionDate: 17-Jul-2002; LatestRevisionNote: Re-released for DXP Platform.; PackageReference: SMB; Publisher: Altium Limited; PackageDescription: DO-214-AA/SMB; 2 C-Bend Leads; Body 5.3 x 3.6 mm, inc. leads (LxW); Code_JEDEC: DO-214-AA
L1 = Inductor: Manufacturer: Bourns Inc.; Manufacturer Part Number: SRR1005-100M; Value: 11uH; Type: Wirewound; Material - Core: Ferrite; Tolerance: ±20%; Current Rating: 2A; Current - Saturation: 3A; Shielding: Shielded; DC Resistance (DCR): 65 mOhm Max; Q @ Freq: 48 @ 2.52MHz; Frequency - Self Resonant: 30MHz; Frequency - Test: 1kHz; Supplier 1: Digi-Key; Supplier Part Number 1: SRR1005-100MCT-ND; RoHS: RoHS Compliant; Category: Inductors, Coils, Chokes; Stock 1: 2322; Pricing 1: 1=0.91, 10=0.854, 25=0.798, 50=0.6838, 100=0.6496, 250=0.59264 (EUR); Packaging: Cut Tape (CT); Operating Temperature: -40°C ~ 125°C; Mounting Type: Surface Mount; Package / Case: Nonstandard; Size / Dimension: 0.500" L x 0.394" W (12.70mm x 10.00mm); Height - Seated (Max): 0.205" (5.20mm); Supplier Device Package: -; ComponentLink1URL: http://www.bourns.com/data/global/pdfs/SRR1005.pdf; ComponentLink1Description: http://www.bourns.com/data/global/pdfs/SRR1005.pdf
L2 = Inductor: Manufacturer: Bourns Inc.; Manufacturer Part Number: SRR1005-7R0M; Type: Wirewound; Material - Core: Ferrite; Tolerance: ±20%; Current Rating: 2.2A; Current - Saturation: 3.2A; Shielding: Shielded; DC Resistance (DCR): 55 mOhm Max; Q @ Freq: 22 @ 7.96MHz; Frequency - Self Resonant: 32MHz; Frequency - Test: 1kHz; Supplier 1: Digi-Key; Supplier Part Number 1: SRR1005-7R0MCT-ND; RoHS: RoHS Compliant; Category: Inductors, Coils, Chokes; Stock 1: 0; Pricing 1: 1=0 (EUR); Packaging: Cut Tape (CT); Operating Temperature: -40°C ~ 125°C; Mounting Type: Surface Mount; Package / Case: Nonstandard; Size / Dimension: 0.500" L x 0.394" W (12.70mm x 10.00mm); Height - Seated (Max): 0.205" (5.20mm); Supplier Device Package: -; ComponentLink1URL: http://www.bourns.com/data/global/pdfs/SRR1005.pdf; ComponentLink1Description: http://www.bourns.com/data/global/pdfs/SRR1005.pdf
LED5 LED6 = LED: as LED7 on sheet Lin-reg; Supplier 1: Digi-Key; Supplier Part Number 1: 475-1410-1-ND; RoHS: RoHS Compliant; Category: Optoelectronics; Stock 1: 152991; Pricing 1: 1=0.1, 10=0.087, 100=0.0691, 250=0.06048, 500=0.05526 (EUR); Packaging: Cut Tape (CT); Color: Green; Package / Case: 0805 (2012 Metric); Size / Dimension: 2.00mm L x 1.25mm W; Mounting Type: Surface Mount; ComponentLink1URL: http://www.osram-os.com/Graphics/XPic9/00078860_0.pdf; ComponentLink1Description: http://www.osram-os.com/Graphics/XPic9/00078860_0.pdf; Supplier Device Package: *; Height (Max): 0.90mm
R25 = Res: as R55 on sheet Lin-reg; Value: 140R; Category: Resistors; ComponentLink1Description: http://www.samsungsem.com/global/support/library/product-catalog/__icsFiles/afieldfile/2015/01/12/CHIP_RESISTOR_150112_1.pdf; ComponentLink1URL: http://www.samsungsem.com/global/support/library/product-catalog/__icsFiles/afieldfile/2015/01/12/CHIP_RESISTOR_150112_1.pdf; Composition: Thick Film; Height: 0.024" (0.60mm); Number of Terminations: 2; Operating Temperature: -55°C ~ 155°C; Package / Case: 0805 (2012 Metric); Packaging: Cut Tape (CT); Pricing 1: 1=0.1, 10=0.022, 25=0.016, 100=0.0092, 500=0.00558, 1000=0.00411, 2500=0.00358 (EUR); RoHS: RoHS Compliant; Size / Dimension: 0.079" L x 0.049" W (2.00mm x 1.25mm); Stock 1: 7060; Supplier 1: Digi-Key; Supplier Device Package: 0805 (2012 Metric); Supplier Part Number 1: 1276-5229-1-ND
R26 = Res: Resistor; Manufacturer: Samsung Electro-Mechanics America, Inc; Manufacturer Part Number: RC2012F4992CS; Resistance (Ohms): 49.9k; Power (Watts): 0.125W, 1/8W; Temperature Coefficient: ±100ppm/°C; Value: 49K9; Supplier 1: Digi-Key; Supplier Part Number 1: 1276-5378-1-ND; RoHS: RoHS Compliant; Category: Resistors; Stock 1: 1527; Pricing 1: 1=0.1, 10=0.022, 25=0.016, 100=0.0092, 500=0.00558, 1000=0.00411, 2500=0.00358 (EUR); Packaging: Cut Tape (CT); Composition: Thick Film; Operating Temperature: -55°C ~ 155°C; Package / Case: 0805 (2012 Metric); Supplier Device Package: 0805 (2012 Metric); Size / Dimension: 0.079" L x 0.049" W (2.00mm x 1.25mm); Height: 0.024" (0.60mm); Number of Terminations: 2; ComponentLink1URL: http://www.samsungsem.com/global/support/library/product-catalog/__icsFiles/afieldfile/2015/01/12/CHIP_RESISTOR_150112_1.pdf; ComponentLink1Description: http://www.samsungsem.com/global/support/library/product-catalog/__icsFiles/afieldfile/2015/01/12/CHIP_RESISTOR_150112_1.pdf
R27 R29 R30 R32 R34 R37 = Res: as R38 on sheet Lin-reg; Value: 1K; Category: Resistors; ComponentLink1Description: http://industrial.panasonic.com/www-cgi/jvcr13pz.cgi?E+PZ+3+AOA0026+ERA6AEB102V+7+WW; ComponentLink1URL: http://industrial.panasonic.com/www-cgi/jvcr13pz.cgi?E+PZ+3+AOA0026+ERA6AEB102V+7+WW; Composition: Thin Film; Height: 0.024" (0.60mm); Number of Terminations: 2; Operating Temperature: -55°C ~ 155°C; Package / Case: 0805 (2012 Metric); Packaging: Cut Tape (CT); Pricing 1: 1=0.64, 50=0.2516, 100=0.194, 250=0.15092, 500=0.10636, 1000=0.07761 (EUR); Resistance (Ohms): 1k; RoHS: RoHS Compliant; Size / Dimension: 0.079" L x 0.049" W (2.00mm x 1.25mm); Stock 1: 142110; Supplier 1: Digi-Key; Supplier Device Package: 0805; Supplier Part Number 1: P1.0KDACT-ND
R28 R31 = Res: as R49 on sheet Lin-reg; Value: 10K; Category: Resistors; ComponentLink1Description: http://www.te.com/commerce/DocumentDelivery/DDEController?Action=srchrtrv&DocNm=1773200&DocType=DS&DocLang=English; ComponentLink1URL: http://www.te.com/commerce/DocumentDelivery/DDEController?Action=srchrtrv&DocNm=1773200&DocType=DS&DocLang=English; Composition: Thin Film; Height: 0.026" (0.65mm); Number of Terminations: 2; Operating Temperature: -55°C ~ 155°C; Package / Case: 0805 (2012 Metric); Packaging: Cut Tape (CT); Pricing 1: 1=0.18, 100=0.1714, 500=0.16136 (EUR); Resistance (Ohms): 10k; RoHS: RoHS Compliant; Size / Dimension: 0.079" L x 0.049" W (2.00mm x 1.25mm); Stock 1: 18690; Supplier 1: Digi-Key; Supplier Device Package: 0805; Supplier Part Number 1: A103142CT-ND
R33 = Res: Resistor; Manufacturer: TE Connectivity AMP Connectors; Manufacturer Part Number: 8-1614884-4; Value: 10K; Power (Watts): 0.1W, 1/10W; Temperature Coefficient: ±25ppm/°C; Category: Resistors; ComponentLink1Description: http://www.te.com/commerce/DocumentDelivery/DDEController?Action=srchrtrv&DocNm=1773200&DocType=DS&DocLang=English; ComponentLink1URL: http://www.te.com/commerce/DocumentDelivery/DDEController?Action=srchrtrv&DocNm=1773200&DocType=DS&DocLang=English; Composition: Thin Film; Height: 0.026" (0.65mm); Number of Terminations: 2; Operating Temperature: -55°C ~ 155°C; Package / Case: 0805 (2012 Metric); Packaging: Cut Tape (CT); Pricing 1: 1=0.18, 100=0.1714, 500=0.16136 (EUR); Resistance (Ohms): 10k; RoHS: RoHS Compliant; Size / Dimension: 0.079" L x 0.049" W (2.00mm x 1.25mm); Stock 1: 18690; Supplier 1: Digi-Key; Supplier Device Package: 0805; Supplier Part Number 1: A103142CT-ND
R35 = Res: Resistor; Manufacturer: Samsung Electro-Mechanics America, Inc; Manufacturer Part Number: RC2012F1400CS; Value: 140R; Power (Watts): 0.125W, 1/8W; Resistance (Ohms): 140; Temperature Coefficient: ±100ppm/°C; Category: Resistors; ComponentLink1Description: http://www.samsungsem.com/global/support/library/product-catalog/__icsFiles/afieldfile/2015/01/12/CHIP_RESISTOR_150112_1.pdf; ComponentLink1URL: http://www.samsungsem.com/global/support/library/product-catalog/__icsFiles/afieldfile/2015/01/12/CHIP_RESISTOR_150112_1.pdf; Composition: Thick Film; Height: 0.024" (0.60mm); Number of Terminations: 2; Operating Temperature: -55°C ~ 155°C; Package / Case: 0805 (2012 Metric); Packaging: Cut Tape (CT); Pricing 1: 1=0.1, 10=0.022, 25=0.016, 100=0.0092, 500=0.00558, 1000=0.00411, 2500=0.00358 (EUR); RoHS: RoHS Compliant; Size / Dimension: 0.079" L x 0.049" W (2.00mm x 1.25mm); Stock 1: 7060; Supplier 1: Digi-Key; Supplier Device Package: 0805 (2012 Metric); Supplier Part Number 1: 1276-5229-1-ND
R36 R75 = Res: as R52 on sheet Lin-reg; Value: 18K; Category: Resistors; ComponentLink1Description: http://industrial.panasonic.com/www-cgi/jvcr13pz.cgi?E+PZ+3+AOA0026+ERA6AEB183V+7+WW; ComponentLink1URL: http://industrial.panasonic.com/www-cgi/jvcr13pz.cgi?E+PZ+3+AOA0026+ERA6AEB183V+7+WW; Composition: Thin Film; Height: 0.024" (0.60mm); Number of Terminations: 2; Operating Temperature: -55°C ~ 155°C; Package / Case: 0805 (2012 Metric); Packaging: Cut Tape (CT); Pricing 1: 1=0.64, 50=0.2516, 100=0.194, 250=0.15092, 500=0.10636, 1000=0.07761 (EUR); Resistance (Ohms): 18k; RoHS: RoHS Compliant; Size / Dimension: 0.079" L x 0.049" W (2.00mm x 1.25mm); Stock 1: 21371; Supplier 1: Digi-Key; Supplier Device Package: 0805; Supplier Part Number 1: P18KDACT-ND
U6 = LT8471: DC/DC conv; Manufacturer: Linear Technology; Manufacturer Part Number: LT8471IFE#PBF; Output Type: Adjustable; Number of Outputs: 2; Frequency - Switching: 100kHz ~ 2MHz; Current - Output: 1.35A (Switch), 2.1A (Switch); Synchronous Rectifier: No; Function: Step-Up, Step-Down, Step-Up/Step-Down; Output Configuration: Positive or Negative; Topology: Buck, Boost, Flyback, SEPIC; Voltage - Input (Min): 2.6V; Voltage - Input (Max): 50V; Voltage - Output (Max): 50V (Switch); Supplier 1: Digi-Key; Supplier Part Number 1: LT8471IFE#PBF-ND; RoHS: RoHS Compliant; Category: Integrated Circuits (ICs); Stock 1: 132; Pricing 1: 1=9.39, 25=6.2776, 100=5.3412 (EUR); Packaging: Tube; Operating Temperature: -40°C ~ 125°C (TJ); Mounting Type: Surface Mount; Package / Case: 20-TSSOP (0.173", 4.40mm Width) Exposed Pad; Supplier Device Package: 20-TSSOP; ComponentLink1URL: http://www.linear.com/docs/44404; ComponentLink1Description: http://www.linear.com/docs/44404; Voltage - Output (Min/Fixed): 2.6V
U7 = AD5245: DigPot; Manufacturer: Analog Devices Inc; Manufacturer Part Number: AD5245BRJZ50-RL7; Configuration: Potentiometer; Number of Circuits: 1; Number of Taps: 256; Resistance (Ohms): 50k; Interface: I²C; Memory Type: Volatile; Voltage - Supply: 2.7 V ~ 5.5 V; Tolerance: ±30%; Temperature Coefficient (Typ): 45 ppm/°C; Resistance - Wiper (Ohms) (Typ): 50; Supplier 1: Digi-Key; Supplier Part Number 1: AD5245BRJZ50-RL7CT-ND; RoHS: RoHS Compliant; Stock 1: 2986; Pricing 1: 1=1.96, 10=1.766, 25=1.582, 100=1.4226, 250=1.26316, 500=1.10372, 1000=0.91364 (EUR); Packaging: Cut Tape (CT); ComponentLink1URL: http://www.analog.com/media/en/technical-documentation/data-sheets/AD5245.pdf; ComponentLink1Description: http://www.analog.com/media/en/technical-documentation/data-sheets/AD5245.pdf; Category: Integrated Circuits (ICs); Taper: Linear; Features: Selectable Address; Operating Temperature: -40°C ~ 125°C; Package / Case: SOT-23-8; Supplier Device Package: SOT-23-8

## Nets that join several sheets
5V: Battery PSU (12 pins), BatteruPSU_SM-reg (C35.1 U7.2 U7.6)
7V: Battery PSU (5 pins), BatteruPSU_SM-reg (7 pins)
GND: Battery PSU (48 pins), Battery manager (8 pins), Lin-reg (26 pins), BatteruPSU_SM-reg (27 pins)
V-boost: Lin-reg (16 pins), BatteruPSU_SM-reg (8 pins)
Vbatt: Battery PSU (5 pins), Battery manager (R73.1 R74.1 TH1.1 U12.10), BatteruPSU_SM-reg (5 pins)
ADC-VBOOST: Battery PSU (U1.44), BatteruPSU_SM-reg (C33.2 R36.2 R37.1)
ADC-VOUT: Battery PSU (U1.41), Lin-reg (C46.2 R64.2 R66.2 R67.1)
C-LIM: Battery PSU (U1.1), Lin-reg (R57.2)
ENCONV: Battery PSU (U1.16), BatteruPSU_SM-reg (R25.1)
I-OUT: Battery PSU (U1.43), Lin-reg (C39.2 R54.1 U8.10)
I-SET: Battery PSU (U1.6), Lin-reg (R52.2 U8.9)
PG1: Battery PSU (U1.32), BatteruPSU_SM-reg (U6.4)
PG2: Battery PSU (U1.33), BatteruPSU_SM-reg (U6.17)
SCL: Battery PSU (LCD1.6 R16.1 U1.11), BatteruPSU_SM-reg (U7.4)
SDA: Battery PSU (LCD1.7 R17.1 U1.10), BatteruPSU_SM-reg (U7.5)
V-SET: Battery PSU (U1.7), Lin-reg (U8.12)